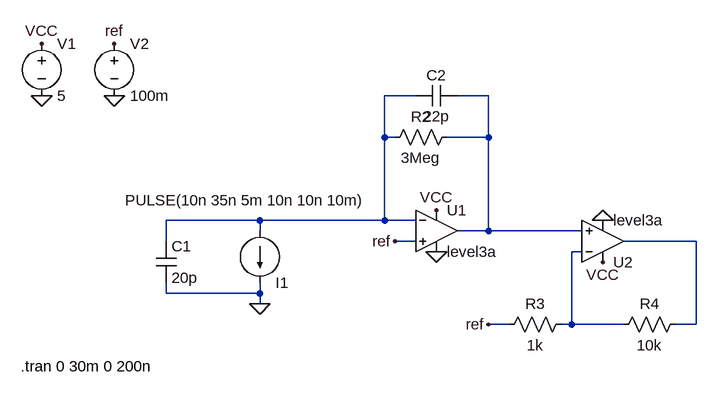
[diagram p0: schematic PhotoGain.asc]
PhotoGain.asc, the LTspice schematic file:
Version 4
SHEET 1 880 680
WIRE 80 -16 32 -16
WIRE 192 -16 144 -16
WIRE 32 48 32 -16
WIRE 48 48 32 48
WIRE 192 48 192 -16
WIRE 192 48 128 48
WIRE -160 176 -304 176
WIRE 32 176 32 48
WIRE 32 176 -160 176
WIRE 80 176 32 176
WIRE -160 192 -160 176
WIRE 192 192 192 48
WIRE 192 192 144 192
WIRE 336 192 192 192
WIRE -304 208 -304 176
WIRE 80 208 48 208
WIRE 512 208 400 208
WIRE 336 224 320 224
WIRE -304 288 -304 272
WIRE -160 288 -160 272
WIRE -160 288 -304 288
WIRE -160 304 -160 288
WIRE 224 336 192 336
WIRE 320 336 320 224
WIRE 320 336 304 336
WIRE 400 336 320 336
WIRE 512 336 512 208
WIRE 512 336 480 336
FLAG -496 -96 VCC
FLAG -496 -16 0
FLAG -384 -16 0
FLAG -384 -96 ref
FLAG 48 208 ref
FLAG 112 224 0
FLAG -160 304 0
FLAG 112 160 VCC
FLAG 368 176 0
FLAG 368 240 VCC
FLAG 192 336 ref
SYMBOL OpAmps\\UniversalOpAmp3 112 192 R0
SYMATTR InstName U1
SYMATTR SpiceLine2 En=0 Enk=0 In=0 Ink=0 Rin=500000Meg
SYMBOL voltage -496 -112 R0
WINDOW 123 0 0 Left 0
WINDOW 39 0 0 Left 0
SYMATTR InstName V1
SYMATTR Value 5
SYMBOL voltage -384 -112 R0
WINDOW 123 0 0 Left 0
WINDOW 39 0 0 Left 0
SYMATTR InstName V2
SYMATTR Value 100m
SYMBOL cap -320 208 R0
SYMATTR InstName C1
SYMATTR Value 20p
SYMBOL res 144 32 R90
WINDOW 0 0 56 VBottom 2
WINDOW 3 32 56 VTop 2
SYMATTR InstName R2
SYMATTR Value 3Meg
SYMBOL cap 144 -32 R90
WINDOW 0 0 32 VBottom 2
WINDOW 3 32 32 VTop 2
SYMATTR InstName C2
SYMATTR Value 22p
SYMBOL OpAmps\\UniversalOpAmp3 368 208 M180
SYMATTR InstName U2
SYMATTR Value2 Avol=1Meg GBW=10Meg Slew=7Meg
SYMATTR SpiceLine2 En=0 Enk=0 In=0 Ink=0 Rin=500000Meg
SYMBOL res 320 320 R90
WINDOW 0 0 56 VBottom 2
WINDOW 3 32 56 VTop 2
SYMATTR InstName R3
SYMATTR Value 1k
SYMBOL res 496 320 R90
WINDOW 0 0 56 VBottom 2
WINDOW 3 32 56 VTop 2
SYMATTR InstName R4
SYMATTR Value 10k
SYMBOL current -160 192 R0
WINDOW 0 24 80 Left 2
WINDOW 3 -207 -47 Left 2
WINDOW 123 0 0 Left 0
WINDOW 39 0 0 Left 0
SYMATTR InstName I1
SYMATTR Value PULSE(10n 35n 5m 10n 10n 10m)
TEXT -528 400 Left 2 !.tran 0 30m 0 200n

The netlist it stands for:
* PhotoGain.asc
XU1 ref N001 VCC 0 N002 level3a En=0 Enk=0 In=0 Ink=0 Rin=500000Meg  ; pins In+ In- V+ V- OUT
V1 VCC 0 5
V2 ref 0 100m
C1 N001 0 20p
R2 N002 N001 3Meg
C2 N002 N001 22p
XU2 N002 N004 VCC 0 N003 level3a Avol=1Meg GBW=10Meg Slew=7Meg En=0 Enk=0 In=0 Ink=0 Rin=500000Meg  ; pins In+ In- V+ V- OUT
R3 N004 ref 1k
R4 N003 N004 10k
I1 N001 0 PULSE(10n 35n 5m 10n 10n 10m)
.tran 0 30m 0 200n
.backanno
.end